# Altium schematic sheet Storage.SchDoc
size A; SheetNumber: 5; SheetTotal: 7
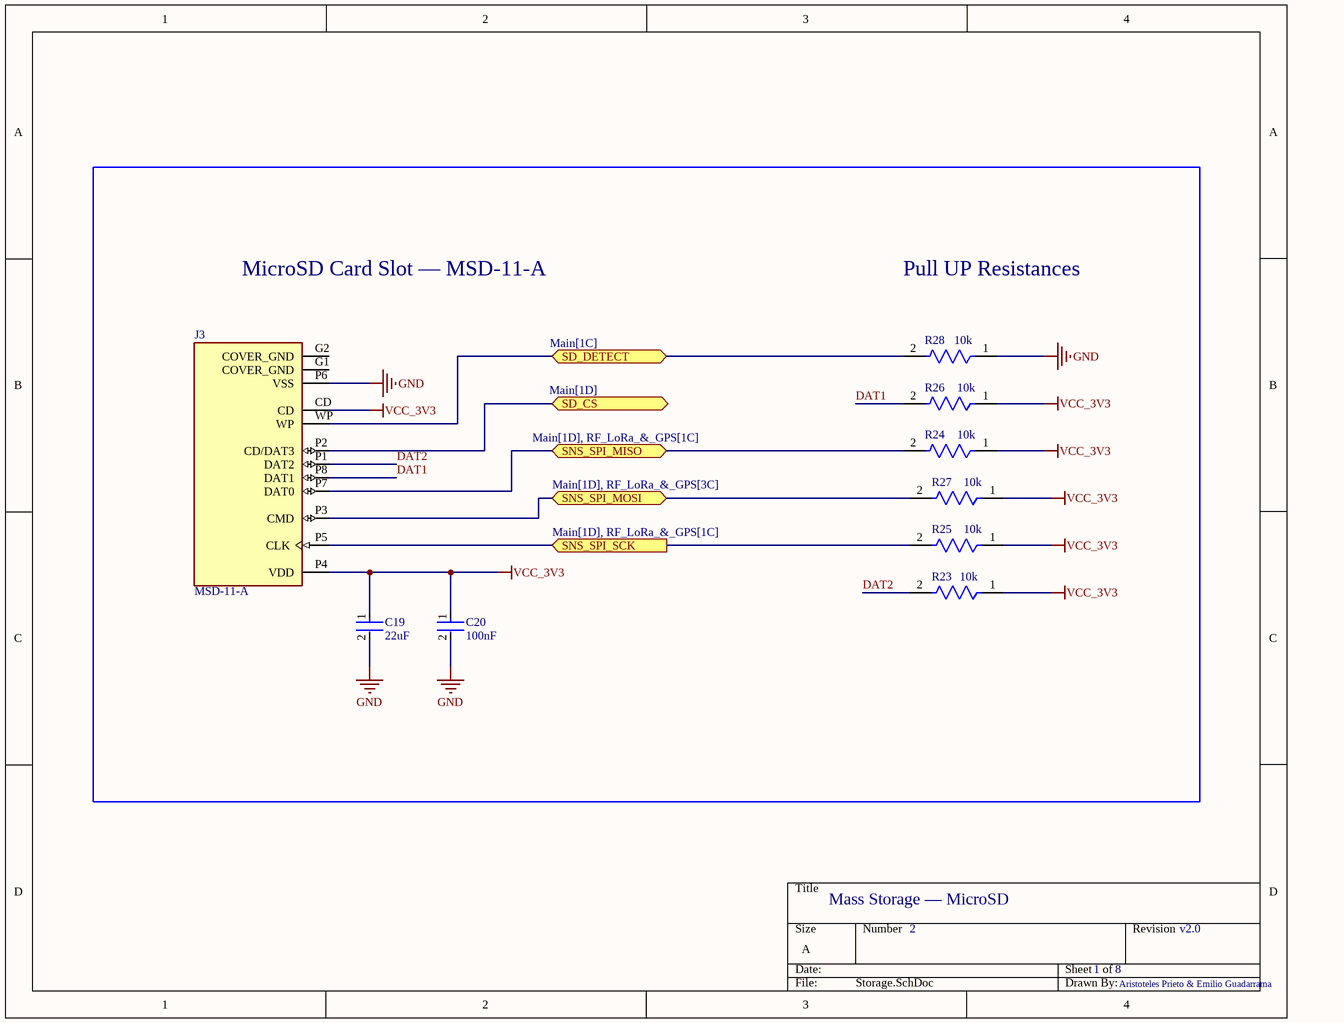
[diagram p0: Storage.SchDoc]

## Parts
C19  22uF  [FP-C0805C-DN-MFG]
C20  100nF  [FP-C0805C-DN-MFG]
J3  MSD-11-A  [CUI_MSD-11-A]
R23  10k  [FP-MCT0603-IPC_A]
R24  10k  [FP-MCT0603-IPC_A]
R25  10k  [FP-MCT0603-IPC_A]
R26  10k  [FP-MCT0603-IPC_A]
R27  10k  [FP-MCT0603-IPC_A]
R28  10k  [FP-MCT0603-IPC_A]

## Ports
SD_CS (bidir, see Main[1D]), SD_DETECT (bidir, see Main[1C]), SNS_SPI_MISO (bidir, see Main[1D], RF_LoRa_&_GPS[1C]), SNS_SPI_MOSI (bidir, see Main[1D], RF_LoRa_&_GPS[3C]), SNS_SPI_SCK (in, see Main[1D], RF_LoRa_&_GPS[1C])

## Nets
GND: C19.2 C20.2 J3.P6(VSS) R28.1
VCC_3V3: C19.1 C20.1 J3.CD J3.P4(VDD) R23.1 R24.1 R25.1 R26.1 R27.1
DAT1: J3.P8(DAT1) R26.2
DAT2: J3.P1(DAT2) R23.2
SD_CS: J3.P2(CD/DAT3) ; port SD_CS
SD_DETECT: J3.WP R28.2 ; port SD_DETECT
SNS_SPI_MISO: J3.P7(DAT0) R24.2 ; port SNS_SPI_MISO
SNS_SPI_MOSI: J3.P3(CMD) R27.2 ; port SNS_SPI_MOSI
SNS_SPI_SCK: J3.P5(CLK) R25.2 ; port SNS_SPI_SCK

Not connected (* = marked no-connect by the designer): J3 G1(COVER_GND) G2(COVER_GND)

## Notes on the sheet
- MicroSD Card Slot — MSD-11-A
- Pull UP Resistances
- Mass Storage — MicroSD
- 2
- 1
- 8
- v2.0
- Aristoteles Prieto & Emilio Guadarrama

## Library data of the parts
C19 C20 = CMP-2007-00279-2: CAP CER 0.1UF 50V X7R 0805; Manufacturer Part Number: C0805C104K5RACTU; Manufacturer: KEMET; Value: 0.10 μF; Tolerance: 0.1; Temperature Coefficient: 30ppm/°C; Material: Ceramic; Device Class L2: Capacitors; Temperature Range Low: -55°C; Voltage Rating: 50 V; Digikey Description: CAP CER 0.1UF 50V X7R 0805; Category: Cap; ComponentLink2Description: Datasheet; Octopart: https://octopart.com/c0805c104k5ractu-kemet-143926; RoHS: TRUE; ComponentLink2URL: https://content.kemet.com/datasheets/KEM_C1003_C0G_SMD.pdf; Temperature Characteristic: X7R; Temperature: -55°C to +125°C; Height: 0.88mm; Temperature Range High: +125°C; Device Class L1: Passive Components; Automotive: No; Lead Free: Yes; Ipc Land Pattern Name: CAPC200125X78; Device Class L3: Ceramic Capacitors; Mouser Description: Cap Ceramic 0.1uF 50V X7R 10% SMD 2.0 x 1.2 mm 125 C Paper T/R; Capacitance: 0.10 μF; Package: C0805C-DN
J3 = MSD-11-A: Micro SD Card Connector, 8 Positions, Connector and Ejector, Push In, Auto Eject Out, Surface Mount, 1.85 mm Heaight Above Board, Gold Flash; MF: Same Sky; SnapEDA_Link: https://www.snapeda.com/parts/MSD-11-A/Same+Sky/view-part/?ref=snap; Package: None; Value: *; MP: MSD-11-A; Check_prices: https://www.snapeda.com/parts/MSD-11-A/Same+Sky/view-part/?ref=eda
R23-R28 = CMP-02407-011165-1: RES SMD 100 OHM 1% 1/8W 0603; Temperature Coefficient: 25ppm/°C; Resistance: 20kR; Power Rating: 125mW; Tolerance: 0.1%; Voltage Rating: 75V; Length: 1.55mm; Case Code (Imperial): 0603; Case/Package: 0603; Construction: Rectangular; Package Quantity: 1000; Number of Terminations: 2; Termination: SMD/SMT; Resistor Type: Thin Film; Features: Automotive AEC-Q200; Series: MCT 0603 - Precision; Max Operating Temperature: 155°C; Depth: 0.85mm; Max Power Dissipation: 125mW; Min Operating Temperature: -55°C; Width: 0.033inch; Case Code (Metric): 1608; Packaging: Tape and Reel; Weight: 6.7E-05oz; Military Standard: Not; Height: 0.022inch